# EAGLE schematic aquaPh (EAGLE 6.4)
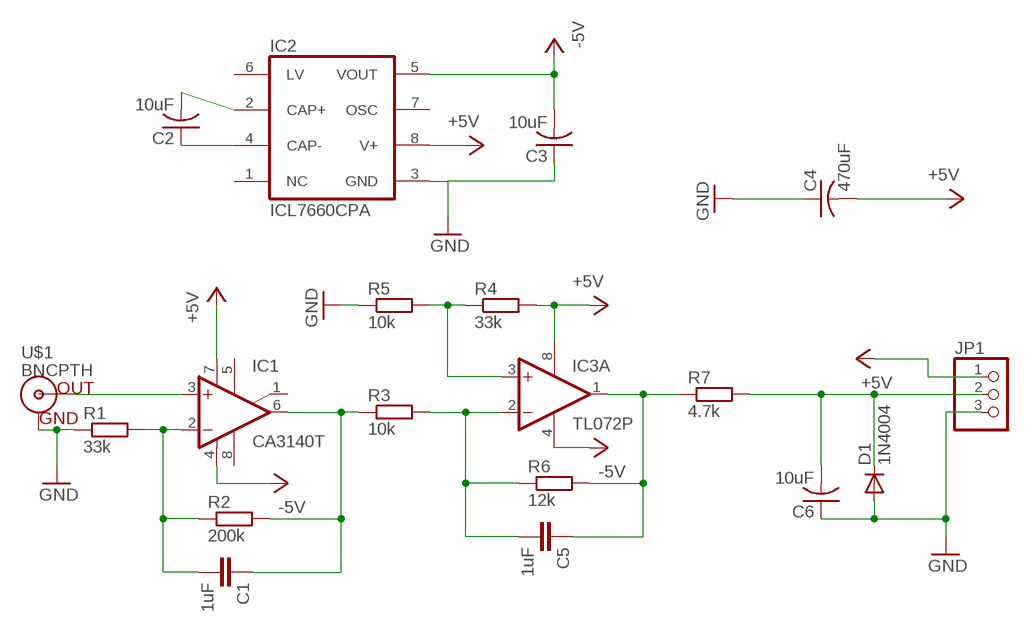
[diagram p0: schematic, sheet 1]

## Parts
C1  1uF  C-EU050-035X075  [C050-035X075]
C2  10uF  C-US075-042X103  [C075-042X103]
C3  10uF  C-US075-042X103  [C075-042X103]
C4  470uF  C-US075-042X103  [C075-042X103]
C5  1uF  C-EU050-035X075  [C050-035X075]
C6  10uF  C-US075-042X103  [C075-042X103]
D1  1N4004  [DO41-10]
IC1  CA3140T  [TO99]
IC2  ICL7660CPA  [DIL08]
IC3  TL072P  [DIL08]
JP1  PINHD-1X3  [1X03]
R1  33k  R-EU_0204/5  [0204/5]
R2  200k  R-EU_0204/5  [0204/5]
R3  10k  R-EU_0204/5  [0204/5]
R4  33k  R-EU_0204/5  [0204/5]
R5  10k  R-EU_0204/5  [0204/5]
R6  12k  R-EU_0204/5  [0204/5]
R7  4.7k  R-EU_0204/5  [0204/5]
U$1  BNCPTH  [BNC]

## Nets
+5V: C4.2 IC1.7(V+) IC2.8(V+) IC3.8(P:V+) JP1.1 R4.2
-5V: C3.2 IC1.4(V-) IC2.5(VOUT) IC3.4(P:V-)
GND: C3.1 C4.1 C6.1 D1.A IC2.3(GND) JP1.3 R1.1 R5.1 U$1.GND
N$1: IC1.3(+IN) U$1.S(OUT)
N$2: C1.2 IC1.2(-IN) R1.2 R2.1
N$3: C2.1 IC2.4(CAP-)
N$4: C2.2 IC2.2(CAP+)
N$5: C1.1 IC1.6(OUT) R2.2 R3.1
N$6: C5.2 IC3.2(A:-IN) R3.2 R6.1
N$7: IC3.3(A:+IN) R4.1 R5.2
N$8: C5.1 IC3.1(A:OUT) R6.2 R7.1
N$9: C6.2 D1.C JP1.2 R7.2
Unconnected: IC1.1(ON/CMP) IC1.5(ON) IC1.8(CMP) IC2.1(NC) IC2.6(LV) IC2.7(OSC) IC3.5(B:+IN) IC3.6(B:-IN) IC3.7(B:OUT)

## Library data of the parts
C1 C5 = rcl:C-EU: CAPACITOR, European symbol
C2-C4 C6 = rcl:C-US: CAPACITOR, American symbol
D1 = adafruit:1N4004: DIODE General purpose 1N400x type rectifier (With bigger pads) http://www.ladyada.net/library/pcb/eaglelibrary.html
IC1 = linear:CA3140: OP AMP
IC2 = maxim:ICL7660CPA: VOLTAGE CONVERTER; MF: INTERSIL; MPN: ICL7660CPA; OC_FARNELL: 1018170; OC_NEWARK: 06F7441
IC3 = linear:TL072: OP AMP
JP1 = pinhead:PINHD-1X3: PIN HEADER
R1-R7 = rcl:R-EU_: RESISTOR, European symbol
U$1 = SparkFun-Connectors:BNC: BNC Connector, Mouser Part# 5227161